# EAGLE design mixer-MAC-24+ (EAGLE 9.5.1)
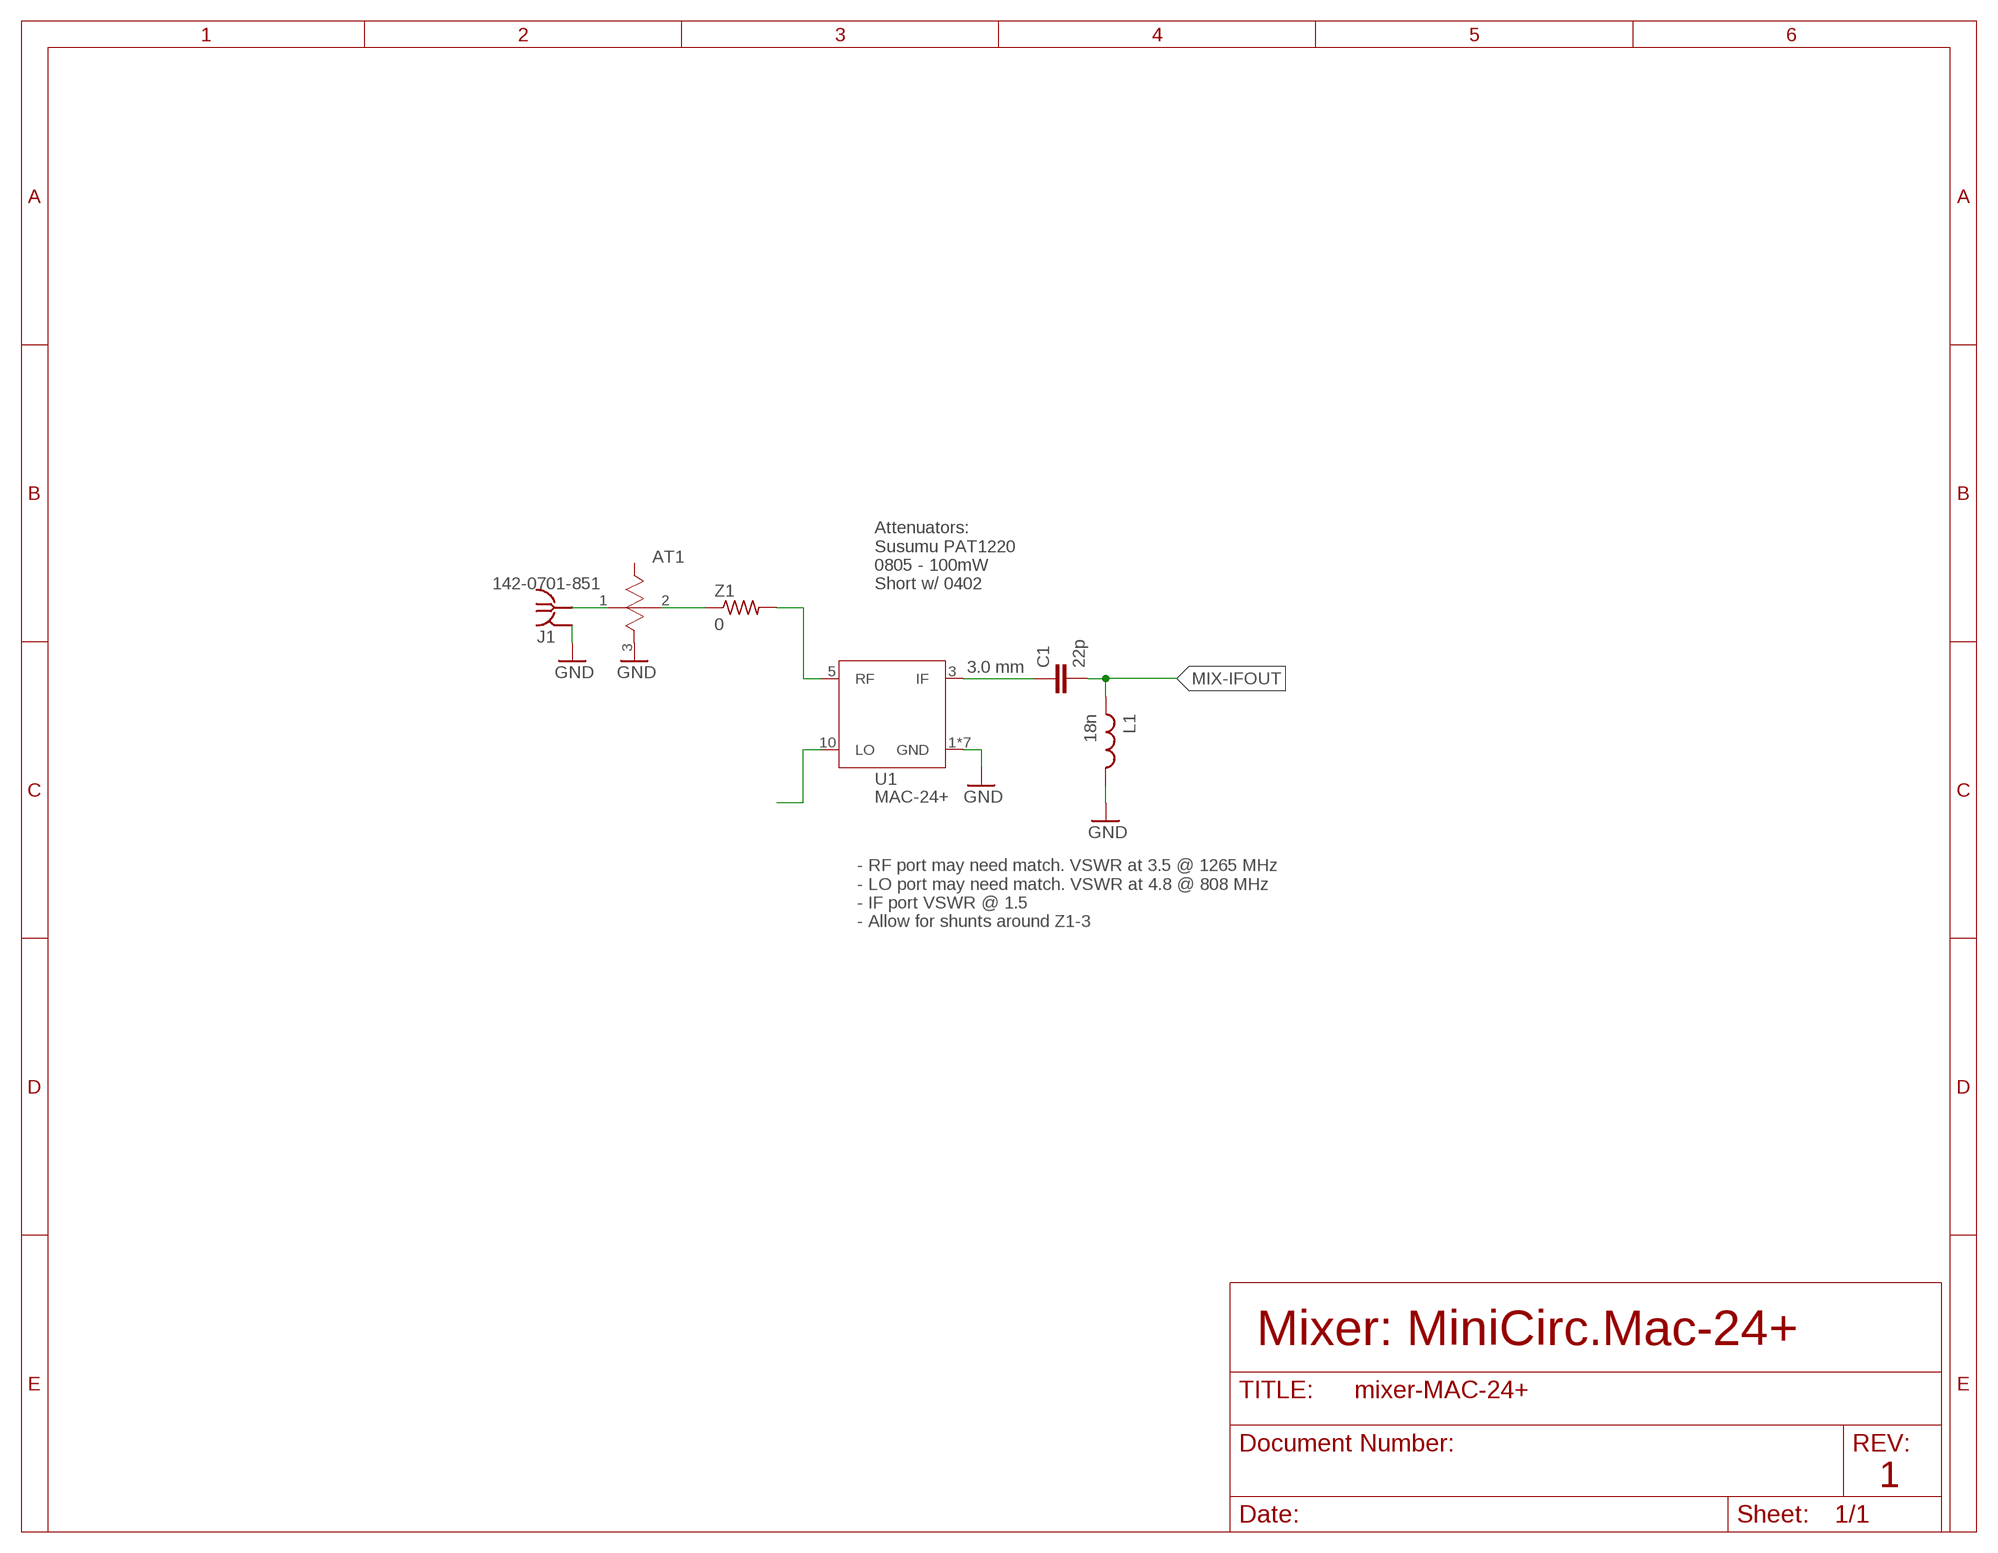
[diagram p0: schematic, sheet 1]

## Parts
AT1  PAT1220  [0805]
C1  22p  C-EU0402-B-NOSILK  [.0402-B-NOSILK]
J1  142-0701-851  [142-0701-851]
L1  18n  L-US0402-B-NOSILK  [.0402-B-NOSILK]
U1  MAC-24+  [MAC-24+]
Z1  0  R-US_0402-C-NOSILK  [.0402-C-NOSILK]

## Nets
GND: AT1.3(GND) J1.GND1(GND) J1.GND2(GND) J1.GND3(GND) J1.GND4(GND) L1.2 U1.1(GND) U1.2(GND) U1.4(GND) U1.6(GND) U1.7(GND) U1.8(GND) U1.9(GND)
MIX-IFOUT [RF1]: C1.2 L1.1
N$1 [RF1]: C1.1 U1.3(IF)
N$4 [RF1]: U1.5(RF) Z1.2
N$6 [RF1]: U1.10(LO)
N$8 [RF1]: AT1.2 Z1.1
RF [RF2]: AT1.1 J1.RF1(RF)

## Notes on the sheet
- Attenuators:
  Susumu PAT1220
  0805 - 100mW
  Short w/ 0402
- 3.0 mm
- - RF port may need match. VSWR at 3.5 @ 1265 MHz
  - LO port may need match. VSWR at 4.8 @ 808 MHz
  - IF port VSWR @ 1.5
  - Allow for shunts around Z1-3
- Mixer: MiniCirc.Mac-24+
- 1

## Library data of the parts
AT1 = AT-Susumu-PAT-attenuator:PAT1220: Chip Attenuator 0805 size (2012 metric) 100 mW Source: Datasheet <https://www.susumu.co.jp/common/pdf/n_catalog_partition16_en.pdf>
C1 = oresat-rcl:C-EU: CAPACITOR, European symbol
J1 = J-Cinch-142-0701-851-SMA-end-launch:142-0701-851: SMA Jack 50Ω - End Launch Source: Datasheet <https://belfuse.com/resources/productinformations/cinchconnectivitysolutions/johnson/pi-ccs-john-142-0701-851.pdf>
L1 = oresat-rcl:L-US: INDUCTOR, American symbol
U1 = U-MiniCirc-Mac-24+-mixer:MAC-24+: RF Mixer, Diode Ring, 0.3 - 12 GHz
Z1 = oresat-rcl:R-US_: RESISTOR, American symbol

## Net classes
1 RF1: clearance 0.5 mm
2 RF2: clearance 0.7 mm

## Board
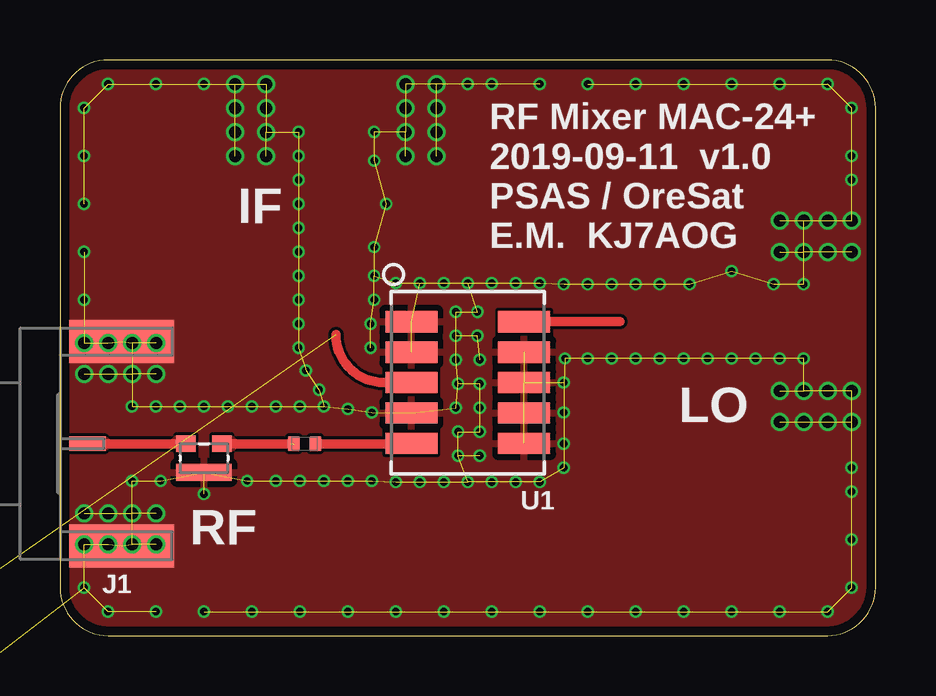
[diagram p1: board, top side]
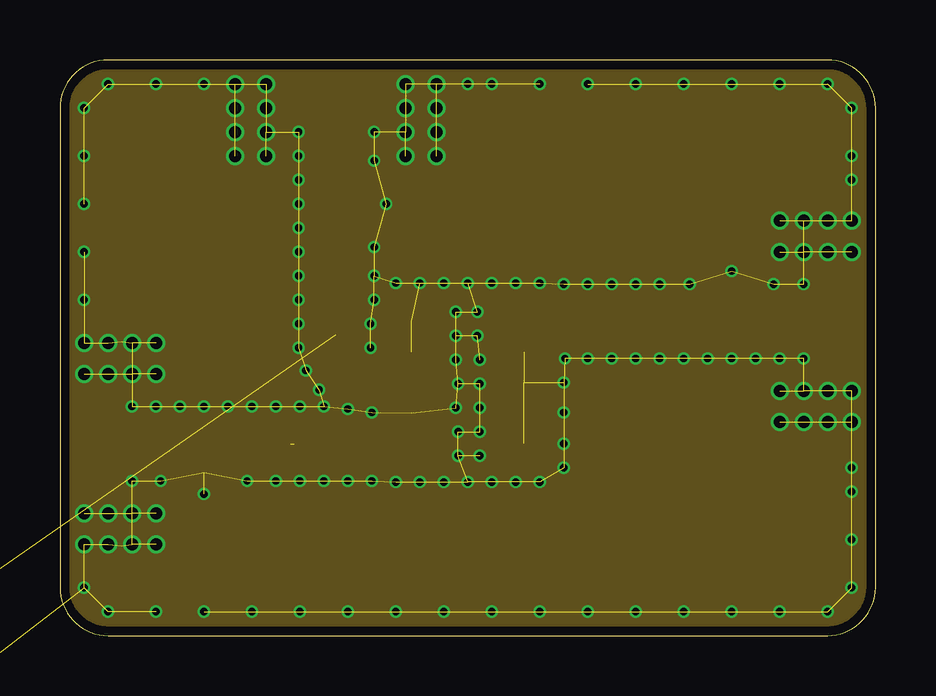
[diagram p2: board, inner layer Route2]
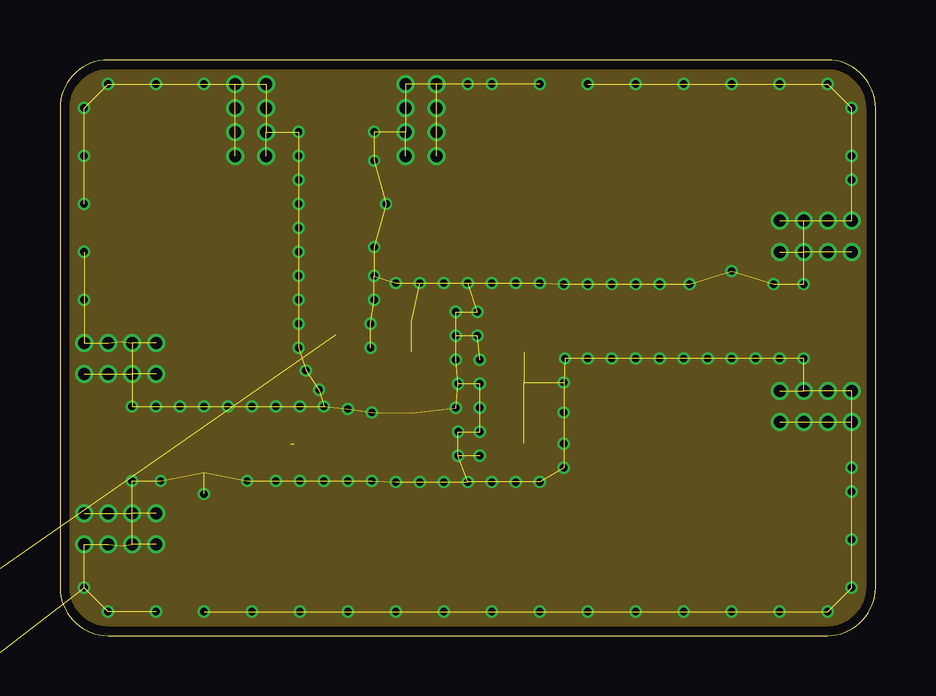
[diagram p3: board, inner layer Route15]
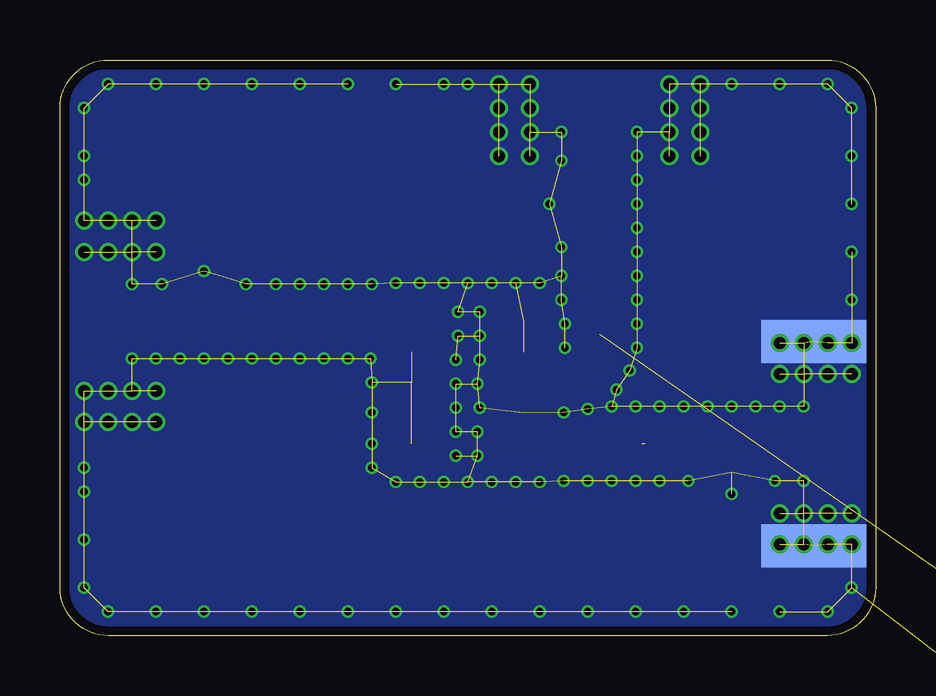
[diagram p4: board, bottom side, seen from below]

Size 34 x 24 mm. Coordinates in mm from the lower left corner, seen from the top.
Outline: 2,0 32,0 arc90 34,2 34,22 arc90 32,24 2,24 arc90 0,22 0,2 arc90 2,0
Copper layers (1*2*15*16): Top 0.035559375mm / dielectric 0.17018125mm / Route2 0.01778125mm / dielectric 47mil / Route15 0.01778125mm / dielectric 0.17018125mm / Bottom 0.035559375mm
Design rules "oshpark-4layer-tented": minimum track width 5mil, minimum drill 10mil, track to track 5mil, track to pad 5mil, pad to pad 5mil, via to via 5mil, smd to smd 5mil, copper to edge 15mil, drill to drill 6mil, minimum pad ring 4mil, minimum via ring 4mil, stop-mask expansion 2.5mil, vias tented up to drill 20mil, thermal gap 10mil

### Footprints (pad centres in the part's own frame; a part is rotated, then mirrored left to right if it is on the bottom)
0805 = smd 0.8 x 0.7: 1 -0.75,0.6; 2 0.75,0.6 | smd 2.3 x 0.7: 3 0,-0.6
.0402-B-NOSILK = smd 0.6 x 0.7: 1 -0.5,0; 2 0.5,0
142-0701-851 = smd 1.8 x 4.37: GND1 -4.255,-2.566; GND2 4.255,-2.566 | smd 1.8 x 4.37 bottom: GND3 -4.255,-2.566; GND4 4.255,-2.566 | smd 0.6 x 1.53: RF1 0,-1.146
MAC-24+ = smd 0.89 x 2.16: 1 -2.54,-2.35; 2 -1.27,-2.35; 3 0,-2.35; 4 1.27,-2.35; 5 2.54,-2.35; 6 2.54,2.35; 7 1.27,2.35; 8 0,2.35; 9 -1.27,2.35; 10 -2.54,2.35
.0402-C-NOSILK = smd 0.5 x 0.6: 1 -0.45,0; 2 0.45,0

### Placement (x,y rotation side)
AT1  6,7.4 0 top
C1  -8.2,-1.5 0 top  (outside the outline)
J1  0,8 90 top
L1  -8.2,-4.7 0 top  (outside the outline)
U1  17,10.55 270 top
Z1  10.2,8 0 top

### Tracks (layer width: path | path; a pad name or v marks a point on that pad's centre or on a via)
GND  (via drill 0.3, 0.5)  (193 unrouted)
  other vias: 15.7,23 14.4,23 14.4,22 14.4,21 14.4,20 15.7,22 15.7,21 15.7,20 7.3,23 7.3,22 7.3,21 7.3,20 8.6,20 8.6,21 8.6,22 8.6,23 33,17.3 32,17.3 31,17.3 30,17.3 30,16 31,16 32,16 33,16 33,8.9 32,8.9 31,8.9 30,8.9 30,10.2 31,10.2 32,10.2 33,10.2 1,3.8 2,3.8 3,3.8 4,3.8 1,5.1 2,5.1 3,5.1 4,5.1 1,12.2 2,12.2 3,12.2 4,12.2 1,10.9 2,10.9 3,10.9 4,10.9 3,6.45 4.2,6.45 7.8,6.45 6,5.9 9,6.45 10,6.45 11,6.45 12,6.45 13,6.45 3,9.55 5,9.55 7,9.55 8,9.55 9,9.55 10,9.55 11,9.55 9.95,21 9.95,19 9.95,17 9.95,16 9.95,15 9.95,14 9.95,13 9.95,12 10.25,11.05 10.8,10.25 13.1,21 13.1,19.8 13.1,16.2 13.1,15 13.1,14 12.95,13 12.95,12 13.6,18 31,11.55 29,11.55 27,11.55 26,11.55 25,11.55 24,11.55 23,11.55 22,11.55 21.05,11.55 31,14.65 29.75,14.65 28,15.2 26.25,14.65 25,14.65 24,14.65 23,14.65 22,14.65 21,14.65 4,9.55 6,9.55 9.95,20 9.95,18 30,11.55 28,11.55 1,22 1,20 1,18 1,16 2,23 4,23 6,23 1,14 32,23 33,22 33,20 33,19 30,23 28,23 26,23 24,23 22,23 20,23 18,23 17,23 1,2 2,1 4,1 6,1 8,1 10,1 12,1 14,1 16,1 18,1 20,1 22,1 24,1 26,1 28,1 30,1 32,1 33,2 33,4 33,6 33,7 14,6.4 15,6.4 16,6.4 17,6.4 18,6.4 19,6.4 20,6.4 21,10.55 21,9.3 21,8 21,7 20,14.7 19,14.7 18,14.7 17,14.7 16,14.7 15,14.7 14,14.7 16.5,13.5 17.4,13.5 16.5,12.5 16.5,11.5 17.5,11.5 17.4,12.5 16.6,10.5 17.5,10.5 17.5,9.5 17.5,8.5 16.6,8.5 16.5,9.5 16.6,7.5 17.5,7.5 12,9.45 13,9.3
  pour Top: 0,0 34,0 34,24 0,24
  pour Route15: 0,0 34,0 34,24 0,24
  pour Bottom: 0,0 34,0 34,24 0,24
  pour Route2: 0,0 34,0 34,24 0,24
  pour Top (no thermals): 6,24 6,19 9,19 9,20 14,20 14,19 17,19 17,24
  pour Top (no thermals): 34,18.6 29,18.6 29,15.6 30,15.6 30,10.6 29,10.6 29,7.6 34,7.6
  pour Top (no thermals): 0,2.5 5,2.5 5,5.5 4,5.5 4,10.5 5,10.5 5,13.5 0,13.5
  pour Bottom (no thermals): 6,24 6,19 9,19 9,20 14,20 14,19 17,19 17,24
  pour Bottom (no thermals): 34,18.6 29,18.6 29,15.6 30,15.6 30,10.6 29,10.6 29,7.6 34,7.6
  pour Bottom (no thermals): 0,2.5 5,2.5 5,5.5 4,5.5 4,10.5 5,10.5 5,13.5 0,13.5
IF
  pour Top (no thermals): 11.3,22.4 11.3,22.1 11.5,21.9 11.7,22.1 11.7,22.4
  pour Top (no thermals): 11.25,18.9 11.25,19.15 11.5,19.4 11.75,19.15 11.75,18.9
LO
  pour Top (no thermals): 32.5,13.3 32.1,13.3 31.9,13.1 32.1,12.9 32.5,12.9
  pour Top (no thermals): 28.75,13.35 29.15,13.35 29.4,13.1 29.15,12.85 28.75,12.85
MIX-IFOUT  (1 unrouted)
  pour Top (no thermals): 11.25,17.1 11.25,16.85 11.5,16.6 11.75,16.85 11.75,17.1
N$1  (1 unrouted)
  Top 0.37: 13.5,10.55 U1.3
  Top 0.39: 11.5,12.55 arc90 13.5,10.55
N$4
  Top 0.37: U1.5
  Top 0.39: Z1.2 U1.5
N$6
  Top 0.39: U1.10 23.34,13.09
N$7
  pour Top (no thermals): 27.15,13.35 26.85,13.35 26.6,13.1 26.85,12.85 27.15,12.85
N$8  (1 unrouted)
  Top 0.39: AT1.2 9.62,8
  pour Top (no thermals): 6.8,8.25 7.15,8.25 7.4,8 7.15,7.75 6.8,7.75
RF
  Top 0.39: AT1.1 J1.RF1
  pour Top (no thermals): 1.6,8.2 1.9,8.2 2.1,8 1.9,7.8 1.6,7.8
  pour Top (no thermals): 5.2,8.25 4.85,8.25 4.6,8 4.85,7.75 5.2,7.75

### Text on the board
tPlace: RF Mixer MAC-24+ / 2019-09-11 v1.0 / PSAS / OreSat / E.M. KJ7AOG | IF | LO | RF